# Altium project PPC_notebook_electrical_schematics_v0.7.PrjPcb (part 11 of 14)

## Sheet 27 Clock 2.SchDoc
size 420 x 297 mm
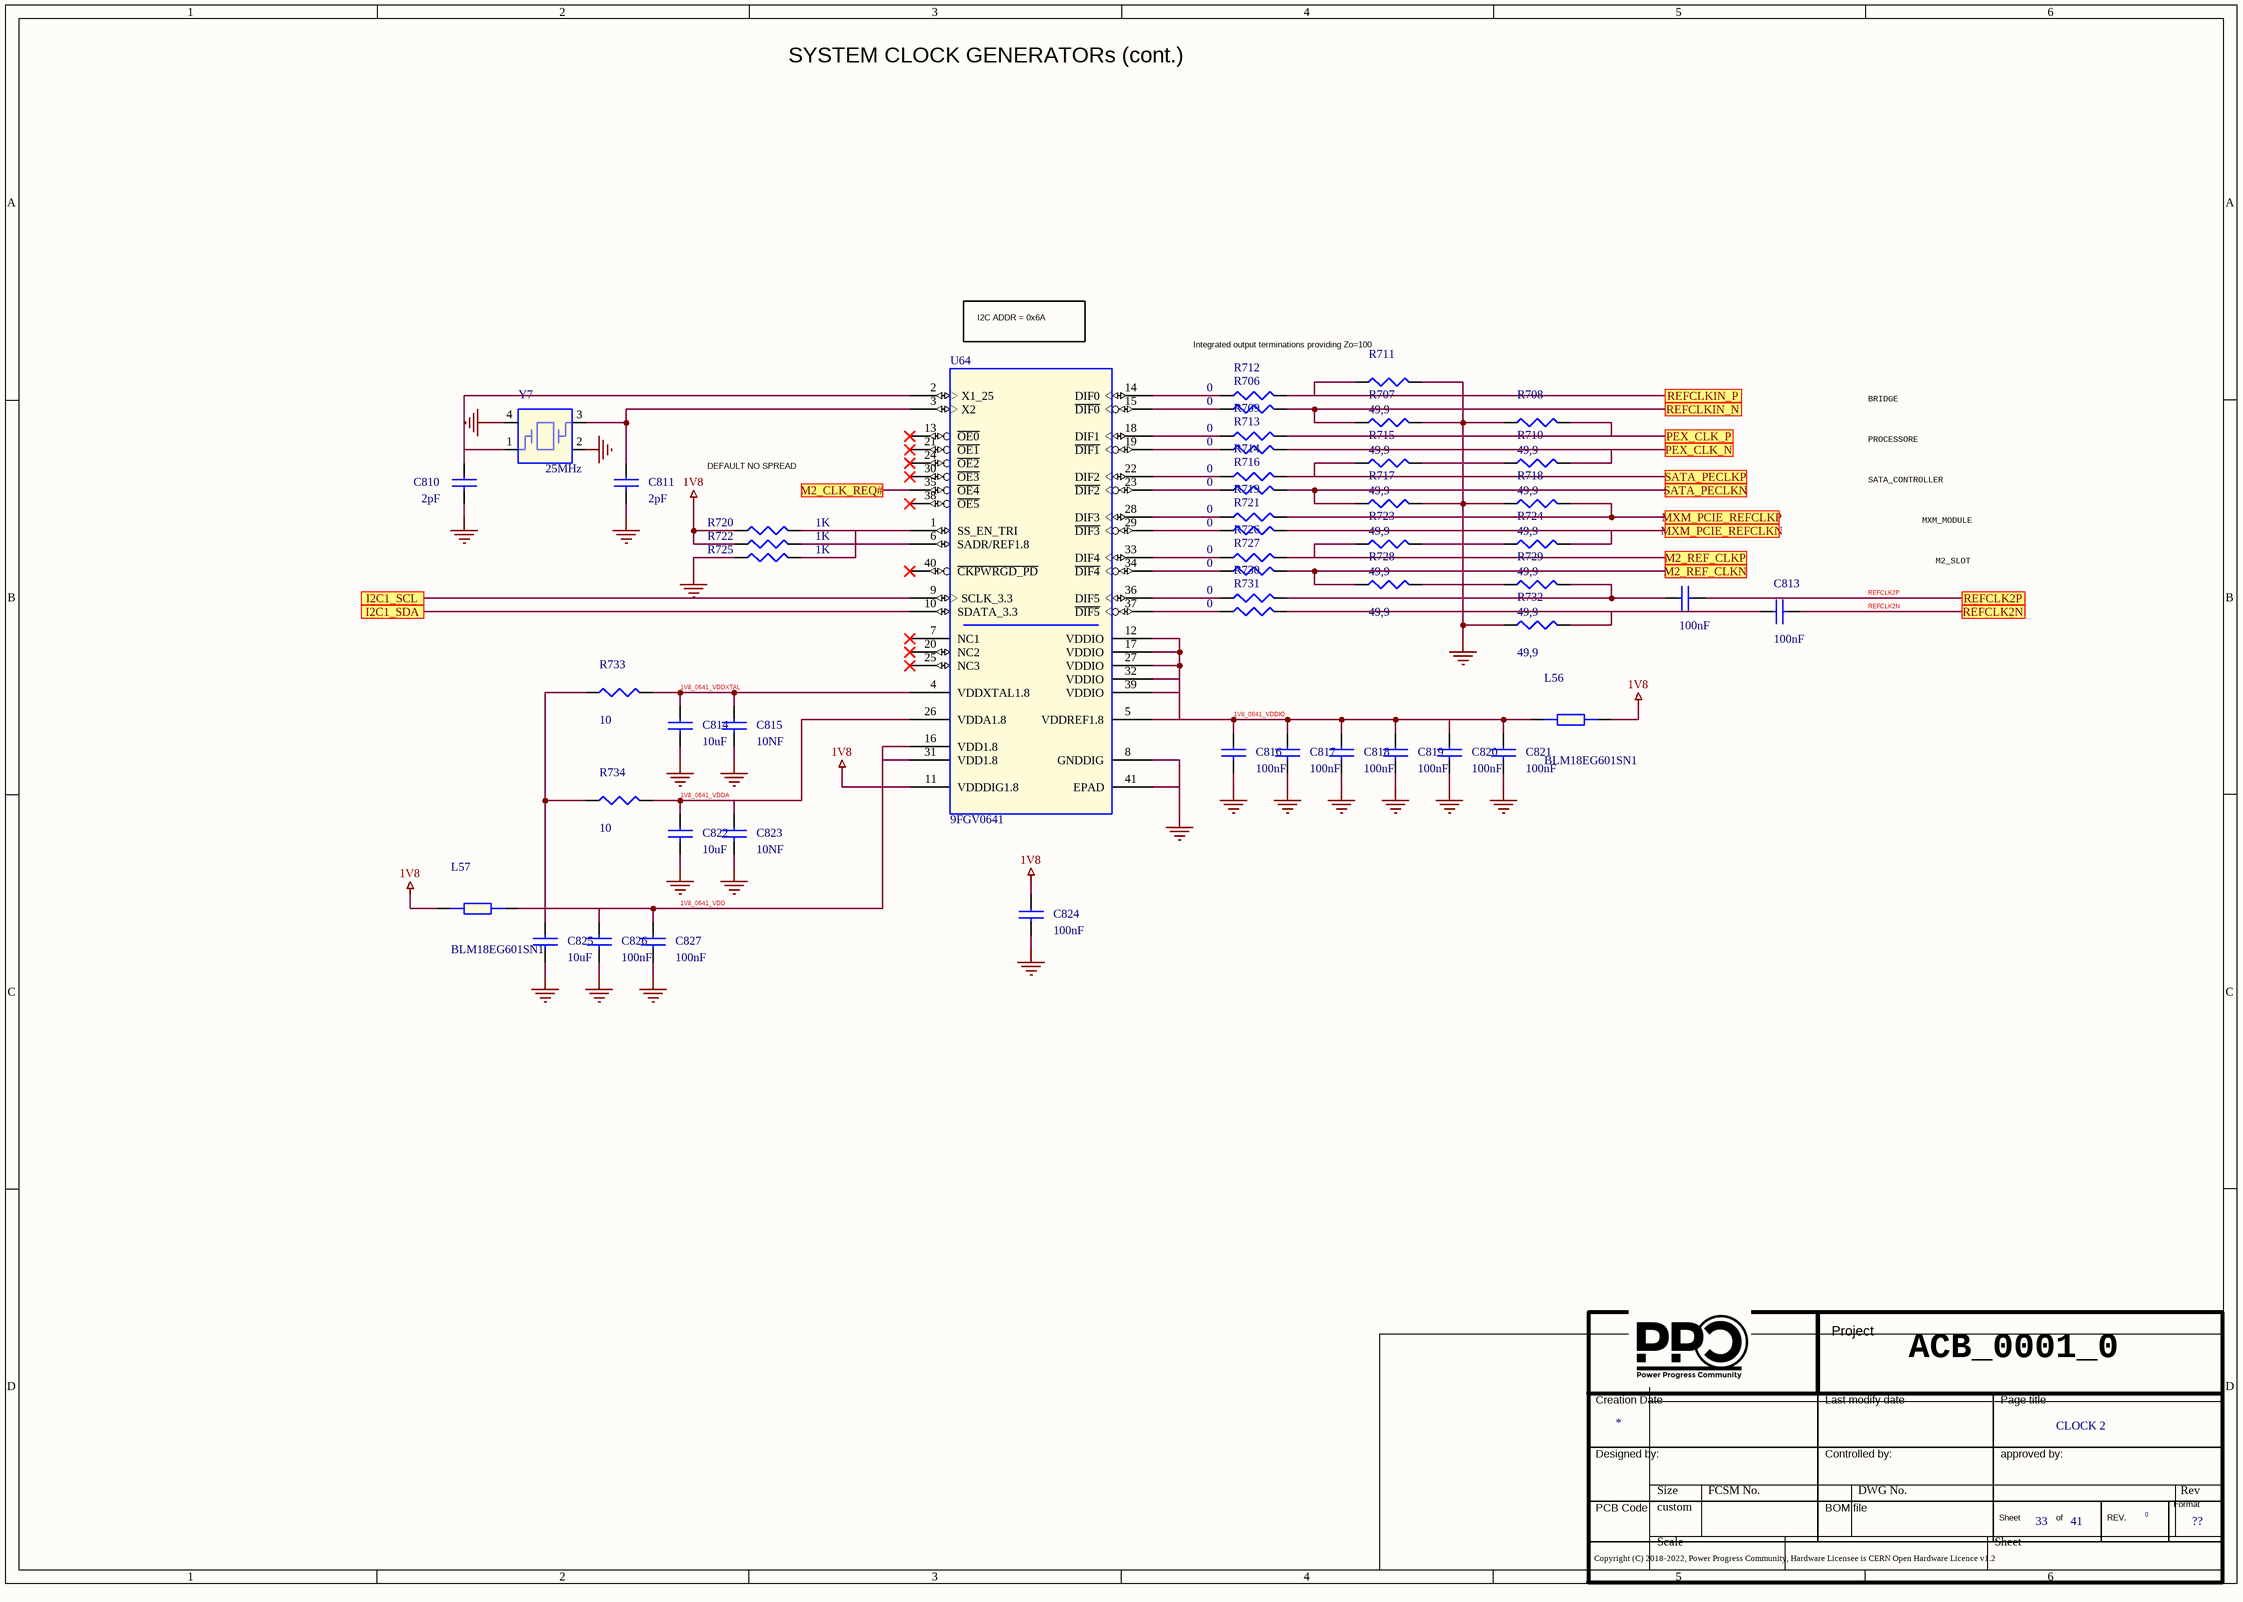
[diagram p59: 27 Clock 2.SchDoc]

### Parts
(Parts that share a designator on the sheet are numbered #1, #2 ... from top to bottom, then left to right.)
*#36  Doc: CLOCK 2  Page Count: 41  Page Number: 33  Page Size: ??  RevCode: 0  (hidden comment: Title_block_PPC)  (graphical)
C810  2pF  [SMD_0402]
C811  2pF  [SMD_0402]
C812  100nF  [SMD_0402]
C813  100nF  [SMD_0402]
C814  10uF  [SMD_0603]
C815  10NF  [SMD_0402]
C816  100nF  [SMD_0402]
C817  100nF  [SMD_0402]
C818  100nF  [SMD_0402]
C819  100nF  [SMD_0402]
C820  100nF  [SMD_0402]
C821  100nF  [SMD_0402]
C822  10uF  [SMD_0603]
C823  10NF  [SMD_0402]
C824  100nF  [SMD_0402]
C825  10uF  [SMD_0603]
C826  100nF  [SMD_0402]
C827  100nF  [SMD_0402]
L56  BLM18EG601SN1  [SMD_0603]
L57  BLM18EG601SN1  [SMD_0603]
R706  0  [SMD_0402]
R707  49,9  [SMD_0402]
R708  49,9  [SMD_0402]
R709  0  [SMD_0402]
R710  49,9  [SMD_0402]
R711  49,9  [SMD_0402]
R712  0  [SMD_0402]
R713  0  [SMD_0402]
R714  0  [SMD_0402]
R715  49,9  [SMD_0402]
R716  0  [SMD_0402]
R717  49,9  [SMD_0402]
R718  49,9  [SMD_0402]
R719  0  [SMD_0402]
R720  1K  [SMD_0402]
R721  0  [SMD_0402]
R722  1K  [SMD_0402]
R723  49,9  [SMD_0402]
R724  49,9  [SMD_0402]
R725  1K  [SMD_0402]
R726  0  [SMD_0402]
R727  0  [SMD_0402]
R728  49,9  [SMD_0402]
R729  49,9  [SMD_0402]
R730  0  [SMD_0402]
R731  0  [SMD_0402]
R732  49,9  [SMD_0402]
R733  10  [SMD_0402]
R734  10  [SMD_0402]
U64  9FGV0641  [qfn_p040_d040_b500_40_e380]
Y7  25MHz  [SMD_5.0x3.2]

### Ports
I2C1_SCL, I2C1_SDA, M2_CLK_REQ#, M2_REF_CLKN, M2_REF_CLKP, MXM_PCIE_REFCLKN, MXM_PCIE_REFCLKP, PEX_CLK_N, PEX_CLK_P, REFCLK2N, REFCLK2P, REFCLKIN_N, REFCLKIN_P, SATA_PECLKN, SATA_PECLKP

### Nets
1V8: C824.1 L56.2 L57.1 R720.1 R722.1 U64.11(VDDDIG1.8)
GND: C810.2 C811.2 C814.2 C815.2 C816.2 C817.2 C818.2 C819.2 C820.2 C821.2 C822.2 C823.2 C824.2 C825.2 C826.2 C827.2 R707.2 R708.1 R710.1 R711.2 R715.2 R717.2 R718.1 R723.2 R724.1 R725.1 R728.2 R729.1 R732.1 U64.8(GNDDIG) U64.41(EPAD) Y7.2 Y7.4
1V8_0641_VDD: C825.1 C826.1 C827.1 L57.2 R733.1 R734.1 U64.16(VDD1.8) U64.31(VDD1.8)
1V8_0641_VDDA: C822.1 C823.1 R734.2 U64.26(VDDA1.8)
1V8_0641_VDDIO: C816.1 C817.1 C818.1 C819.1 C820.1 C821.1 L56.1 U64.5(VDDREF1.8) U64.12(VDDIO) U64.17(VDDIO) U64.27(VDDIO) U64.32(VDDIO) U64.39(VDDIO)
1V8_0641_VDDXTAL: C814.1 C815.1 R733.2 U64.4(VDDXTAL1.8)
REFCLK2N: C813.2 ; port REFCLK2N
REFCLK2P: C812.2 ; port REFCLK2P
REFCLKIN_N: R706.2 R707.1 ; port REFCLKIN_N
REFCLKIN_P: R711.1 R712.2 ; port REFCLKIN_P
NetC113_1: R710.2 R713.2 ; port PEX_CLK_N
NetC114_1: R708.2 R709.2 ; port PEX_CLK_P
NetC810_1: C810.1 U64.2(X1_25) Y7.1
NetC811_1: C811.1 U64.3(X2) Y7.3
NetC812_1: C812.1 R729.2 R730.2
NetC813_1: C813.1 R731.2 R732.2
NetJ13_53: R727.2 R728.1 ; port M2_REF_CLKN
NetJ13_55: R723.1 R726.2 ; port M2_REF_CLKP
NetJ18_153: R721.2 R724.2 ; port MXM_PCIE_REFCLKN
NetJ18_155: R718.2 R719.2 ; port MXM_PCIE_REFCLKP
NetR108_1: U64.10(SDATA_3.3) ; port I2C1_SDA
NetR109_1: U64.9(SCLK_3.3) ; port I2C1_SCL
NetR420_2: R714.2 R715.1 ; port SATA_PECLKP
NetR421_2: R716.2 R717.1 ; port SATA_PECLKN
NetR435_1: U64.35(~{OE4}) ; port M2_CLK_REQ#
NetR706_1: R706.1 U64.15(~{DIF0})
NetR709_1: R709.1 U64.18(DIF1)
NetR712_1: R712.1 U64.14(DIF0)
NetR713_1: R713.1 U64.19(~{DIF1})
NetR714_1: R714.1 U64.22(DIF2)
NetR716_1: R716.1 U64.23(~{DIF2})
NetR719_1: R719.1 U64.28(DIF3)
NetR720_2: R720.2 R725.2 U64.1(SS_EN_TRI)
NetR721_1: R721.1 U64.29(~{DIF3})
NetR722_2: R722.2 U64.6(SADR/REF1.8)
NetR726_1: R726.1 U64.33(DIF4)
NetR727_1: R727.1 U64.34(~{DIF4})
NetR730_1: R730.1 U64.36(DIF5)
NetR731_1: R731.1 U64.37(~{DIF5})

Not connected (* = marked no-connect by the designer): U64 7(NC1)* 13(~{OE0})* 20(NC2)* 21(~{OE1})* 24(~{OE2})* 25(NC3)* 30(~{OE3})* 38(~{OE5})* 40(~{CKPWRGD_PD})*

### Notes on the sheet
- SYSTEM CLOCK GENERATORs (cont.)
- I2C ADDR = 0x6A
- Integrated output terminations providing Zo=100
- BRIDGE
- PROCESSORE
- DEFAULT NO SPREAD
- SATA_CONTROLLER
- MXM_MODULE
- M2_SLOT
- ACB_0001_0

### Library data of the parts
*#36 = Title_block_PPC: Title: T2080PCIe; Author: MICETEK; Page Create Date: March  8, 1995; Page Title: ?; Page Modify Date: *
C810 = CAP NP_Dup3: CAP CER 2PF 50V C0G/NPO 0402; Part Number: PASSIVE_1453; Manufacturer 1: YAGEO; Manufacturer Part Number 1: CC0402CRNPO9BN2R0D; RSM: RC0402; Part Type: Capacitors\Ceramic\SMD\0402; PCB Footprint: SMD_0402
C811 = CAP NP_Dup3: CAP CER 2PF 50V C0G/NPO 0402; Manufacturer Part Number 1: CC0402CRNPO9BN2R0D; Manufacturer 1: YAGEO; Part Number: PASSIVE_1453; RSM: RC0402; PCB Footprint: SMD_0402; Part Type: Capacitors\Ceramic\SMD\0402
C812 C813 = CAP NP_Dup3: as C755 on sheet 24 AUDIO CMEDIA; PCB Footprint: SMD_0402; Part Type: Capacitors\Ceramic\SMD\0402
C814 C822 C825 = CAP NP_Dup3: as C748 on sheet 24 AUDIO CMEDIA; PCB Footprint: SMD_0603; Part Type: Capacitors\Ceramic\SMD\0603
C815 C823 = CAP NP_Dup3: as C801 on sheet 26 Clock 1; Part Type: Capacitors\Ceramic\SMD\0402; PCB Footprint: SMD_0402
C816-C821 C824 C826 C827 = CAP NP_Dup3: as C765 on sheet 24 AUDIO CMEDIA; Part Type: Capacitors\Ceramic\SMD\0402; PCB Footprint: SMD_0402
L56 L57 = FERRITE_BEAD: as L44 on sheet 25 AUDIO_CONN; Part Type: Ferrite Beads\SMD\0603; PCB Footprint: SMD_0603
R706 R709 R712-R714 R716 R719 R721 R726 R727 R730 R731 = R_Dup6: as R612 on sheet 22 MXM_VIDEO_OUT; Part Type: Resistors\Fixed\SMD\0402\5%; Manufacturer Part Number 1: RESIS.CHIP 0R 5% 0402 SMD; PCB Footprint: SMD_0402
R707 R708 R710 R711 R715 R717 R718 R723 R724 R728 R729 R732 = R_Dup6: RESIS.CHIP 49,9R 1% 0402 SMD; Manufacturer Part Number 1: NCR04F49R9TRF; Manufacturer 1: NIC; Part Number: PASSIVE_738; RSM: RC0402; Part Type: Resistors\Fixed\SMD\0402\1%; PCB Footprint: SMD_0402
R720 R722 R725 = R_Dup6: as R671 on sheet 25 AUDIO_CONN; Part Type: Resistors\Fixed\SMD\0402\1%; Manufacturer Part Number 1: RESIS.CHIP 1K 1% 0402 SMD; PCB Footprint: SMD_0402
R733 R734 = R_Dup6: RESIS.CHIP 10R 5% 0402 SMD; Manufacturer 1: ROYAL OHM; Part Number: PASSIVE_811; RSM: RC0402; Manufacturer Part Number 1: RESIS.CHIP 10R 5% 0402 SMD; Part Type: Resistors\Fixed\SMD\0402\5%; PCB Footprint: SMD_0402
U64 = IDT9FGV0641: PCIe Gen1–4 clock generation for Riser Cards; Manufacturer 1: IDT; Part Number: LOGIC_359; MPN: 9FGV0641AKLF; RSM: QFN-40-5X5-P0_4-EP; PCB Footprint: 40-VFQFPN; Distributor 1: IDT; Manufacturer Part Number 1: 9FGV0641; Part Type: CLOCK\GENERATOR; TYPE: IC; Vendor: IDT
Y7 = CRYSTAL_4P: CRYSTAL 25.000 MHZ 20PF SMD; Manufacturer Part Number 1: ECS-250-20-30B-TR (ROHS COMPLIANT); Manufacturer 1: ECS; Part Number: MISC_166; RSM: XC-CSX2; PCB Footprint: SMD_5.0x3.2; Distributor 1: DIGIKEY (XC1124CT-ND); Part Type: Quartz

## Sheet 28 Core Pwr.SchDoc
size 420 x 297 mm
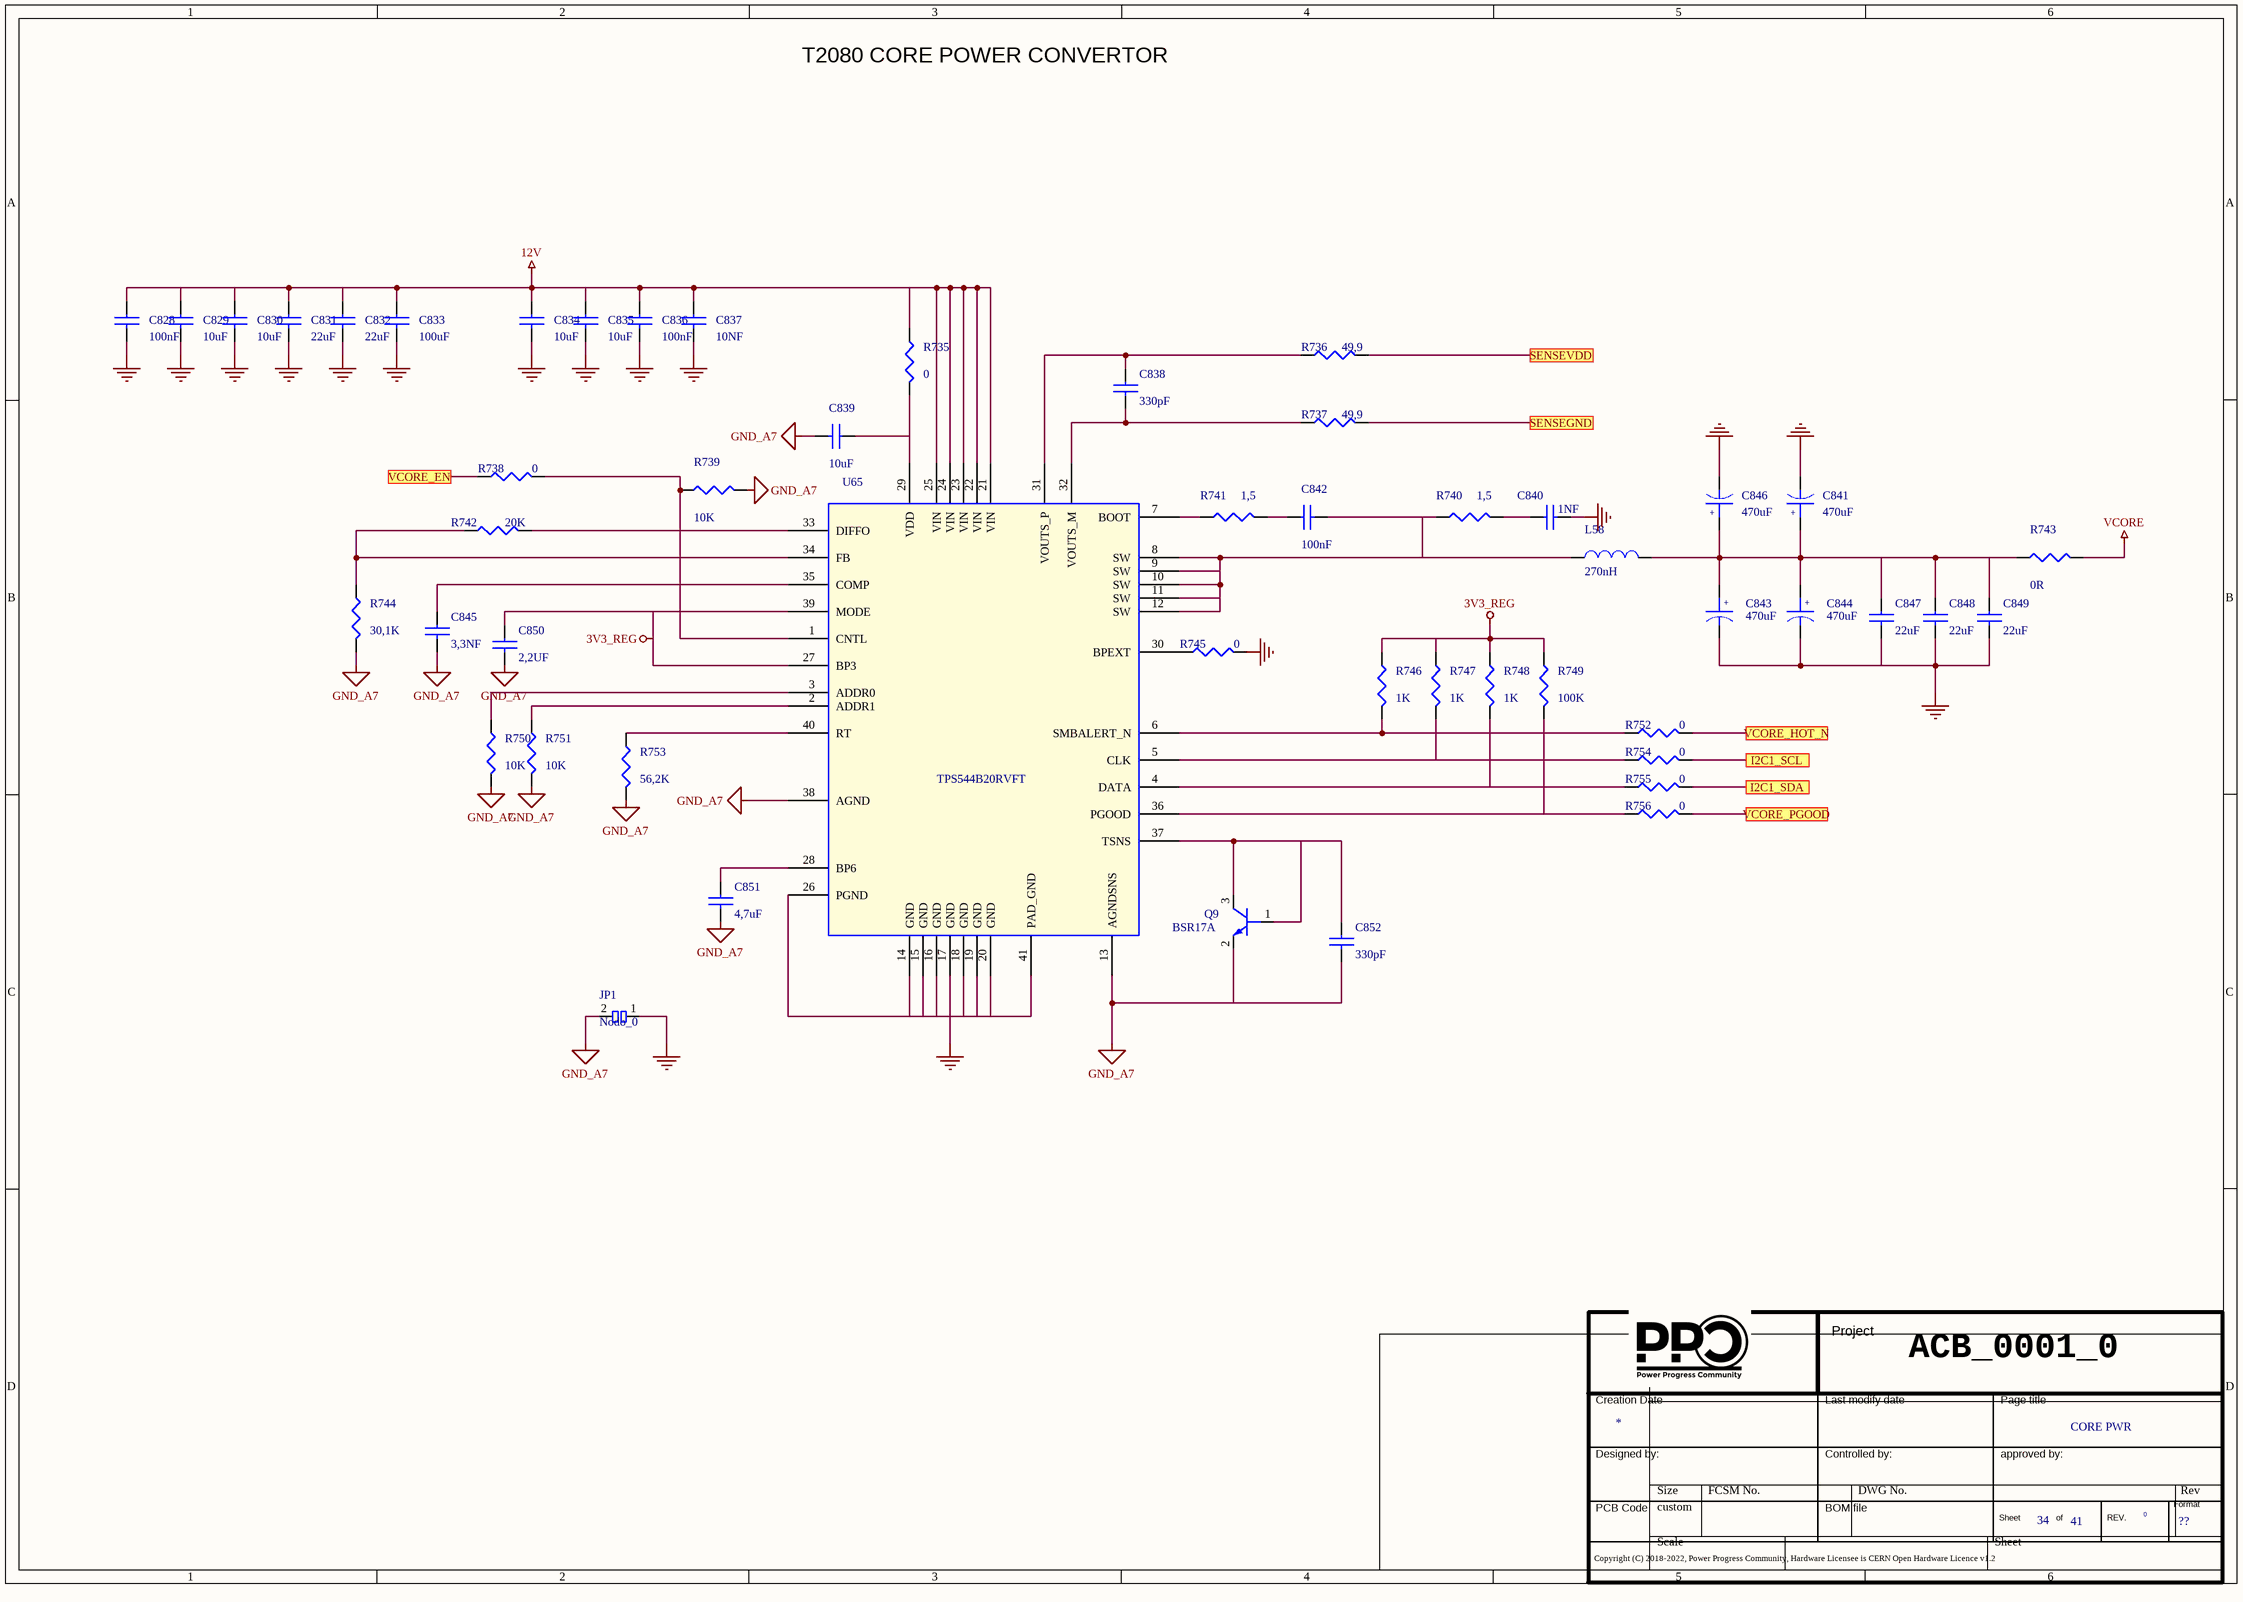
[diagram p60: 28 Core Pwr.SchDoc]

### Parts
(Parts that share a designator on the sheet are numbered #1, #2 ... from top to bottom, then left to right.)
*#37  Doc: CORE PWR  Page Count: 41  Page Number: 34  Page Size: ??  RevCode: 0  (hidden comment: Title_block_PPC)  (graphical)
C828  100nF  [SMD_0402]
C829  10uF  [SMD_0603]
C830  10uF  [SMD_0603]
C831  22uF  [SMD_0805]
C832  22uF  [SMD_0805]
C833  100uF  [SMD_1210]
C834  10uF  [SMD_0603]
C835  10uF  [SMD_0603]
C836  100nF  [SMD_0402]
C837  10NF  [SMD_0402]
C838  330pF  [SMD_0402]
C839  10uF  [SMD_0603]
C840  1NF  [SMD_0402]
C841  470uF  [SMD_CASE_GX]
C842  100nF  [SMD_0402]
C843  470uF  [SMD_CASE_GX]
C844  470uF  [SMD_CASE_GX]
C845  3,3NF  [SMD_0402]
C846  470uF  [SMD_CASE_GX]
C847  22uF  [SMD_1206]
C848  22uF  [SMD_1206]
C849  22uF  [SMD_1206]
C850  2,2UF  [SMD_0402]
C851  4,7uF  [SMD_0402]
C852  330pF  [SMD_0402]
JP1  Nodo_0
L58  270nH  [SMD_7_65X11mm]
Q9  BSR17A  [SOT_23]
R735  0  [SMD_1206]
R736  49,9  [SMD_0402]
R737  49,9  [SMD_0402]
R738  0  [SMD_0402]
R739  10K  [SMD_0402]
R740  1,5  [SMD_0402]
R741  1,5  [SMD_0402]
R742  20K  [SMD_0402]
R743  0R  [SMD_2010]
R744  30,1K  [SMD_0402]
R745  0  [SMD_0402]
R746  1K  [SMD_0402]
R747  1K  [SMD_0402]
R748  1K  [SMD_0402]
R749  100K  [SMD_0402]
R750  10K  [SMD_0402]
R751  10K  [SMD_0402]
R752  0  [SMD_0402]
R753  56,2K  [SMD_0402]
R754  0  [SMD_0402]
R755  0  [SMD_0402]
R756  0  [SMD_0402]
U65  TPS544B20RVFT  [LQFN40]

### Ports
I2C1_SCL, I2C1_SDA, SENSEGND, SENSEVDD, VCORE_EN, VCORE_HOT_N, VCORE_PGOOD

### Nets
3V3_REG: C850.1 R746.1 R747.1 R748.1 R749.1 U65.27(BP3) U65.39(MODE)
12V: C828.1 C829.1 C830.1 C831.1 C832.1 C833.1 C834.1 C835.1 C836.1 C837.1 R735.1 U65.21(VIN) U65.22(VIN) U65.23(VIN) U65.24(VIN) U65.25(VIN)
GND: C828.2 C829.2 C830.2 C831.2 C832.2 C833.2 C834.2 C835.2 C836.2 C837.2 C840.2 C841.2 C843.2 C844.2 C846.2 C847.2 C848.2 C849.2 JP1.1 R745.2 U65.14(GND) U65.15(GND) U65.16(GND) U65.17(GND) U65.18(GND) U65.19(GND) U65.20(GND) U65.26(PGND) U65.41(PAD_GND)
GND_A7: C839.2 C845.2 C850.2 C851.2 C852.2 JP1.2 Q9.2(E) R739.2 R744.2 R750.2 R751.2 R753.2 U65.13(AGNDSNS) U65.38(AGND)
VCORE: R743.2
NetC838_1: C838.1 R736.1 U65.31(VOUTS_P)
NetC838_2: C838.2 R737.1 U65.32(VOUTS_M)
NetC839_1: C839.1 R735.2 U65.29(VDD)
NetC840_1: C840.1 R740.2
NetC841_1: C841.1 C843.1 C844.1 C846.1 C847.1 C848.1 C849.1 L58.2 R743.1
NetC842_1: C842.1 R741.2
NetC842_2: C842.2 L58.1 R740.1 U65.8(SW) U65.9(SW) U65.10(SW) U65.11(SW) U65.12(SW)
NetC845_1: C845.1 U65.35(COMP)
NetC851_1: C851.1 U65.28(BP6)
NetC852_1: C852.1 Q9.1(B) Q9.3(C) U65.37(TSNS)
NetR108_1: R755.2 ; port I2C1_SDA
NetR109_1: R754.2 ; port I2C1_SCL
NetR292_2: R738.1 ; port VCORE_EN
NetR338_2: R756.2 ; port VCORE_PGOOD
NetR342_2: R752.2 ; port VCORE_HOT_N
NetR736_2: R736.2 ; port SENSEVDD
NetR737_2: R737.2 ; port SENSEGND
NetR738_2: R738.2 R739.1 U65.1(CNTL)
NetR741_1: R741.1 U65.7(BOOT)
NetR742_1: R742.1 R744.1 U65.34(FB)
NetR742_2: R742.2 U65.33(DIFFO)
NetR745_1: R745.1 U65.30(BPEXT)
NetR746_2: R746.2 R752.1 U65.6(SMBALERT_N)
NetR747_2: R747.2 R754.1 U65.5(CLK)
NetR748_2: R748.2 R755.1 U65.4(DATA)
NetR749_2: R749.2 R756.1 U65.36(PGOOD)
NetR750_1: R750.1 U65.3(ADDR0)
NetR751_1: R751.1 U65.2(ADDR1)
NetR753_1: R753.1 U65.40(RT)

### Notes on the sheet
- T2080 CORE POWER CONVERTOR
- ACB_0001_0
- (in symbol CAP POL) +

### Library data of the parts
*#37 = Title_block_PPC: Title: T2080PCIe; Author: MICETEK; Page Create Date: March  8, 1995; Page Title: ?; Page Modify Date: *
C828 C836 = CAP NP_Dup3: as C755 on sheet 24 AUDIO CMEDIA; PCB Footprint: SMD_0402; Part Type: Capacitors\Ceramic\SMD\0402
C829 C830 C834 C835 C839 = CAP NP_Dup3: as C782 on sheet 25 AUDIO_CONN; PCB Footprint: SMD_0603; Part Type: Capacitors\Ceramic\SMD\0603
C831 C832 = CAP NP_Dup3: 22UF 35V 20% 0805; Part Number: PASSIVE_224; Manufacturer 1: TDK; Manufacturer Part Number 1: C2012X5R1V226M125AC; RSM: RC0805; PCB Footprint: SMD_0805; Part Type: Capacitors\Ceramic\SMD\0805
C833 = CAP NP_Dup3: as C796 on sheet 25 AUDIO_CONN; PCB Footprint: SMD_1210; Part Type: Capacitors\Ceramic\SMD\1210
C837 = CAP NP_Dup3: COND.CER. 10NF 16V 0402 X7R SMD; Manufacturer Part Number 1: 0402YC103KAT2A; Manufacturer 1: AVX; Part Number: PASSIVE_28; RSM: RC0402; PCB Footprint: SMD_0402; Part Type: Capacitors\Ceramic\SMD\0402
C838 C852 = CAP NP_Dup3: CAP CER 330PF 50V 5% C0G 0402 HiRel; Manufacturer Part Number 1: CGJ2B2C0G1H331J050BA; Manufacturer 1: TDK; Part Number: PASSIVE_73; RSM: RC0402; PCB Footprint: SMD_0402; Part Type: Capacitors\Ceramic\SMD\0402
C840 = CAP NP_Dup3: COND.CER. 1NF 50V 0402 X7R SMD; Manufacturer Part Number 1: GRM15XR71H102KA86D; Manufacturer 1: Murata; Part Number: PASSIVE_47; RSM: RC0402; PCB Footprint: SMD_0402; Part Type: Capacitors\Ceramic\SMD\0402
C841 C846 = CAP POL: COND.TANT. 470uF 2v CASE-GX SMD; Part Number: PASSIVE_1473; Manufacturer 1: PANASONIC; Manufacturer Part Number 1: EEF-GX0D471R; RSM: TANT-D; PCB Footprint: SMD_CASE_GX; Part Type: Capacitors\Tantalum\SMD\CASE_GX
C842 = CAP NP_Dup3: as C765 on sheet 24 AUDIO CMEDIA; PCB Footprint: SMD_0402; Part Type: Capacitors\Ceramic\SMD\0402
C843 C844 = CAP POL: COND.TANT. 470uF 2v CASE-GX SMD; Manufacturer Part Number 1: EEF-GX0D471R; Manufacturer 1: PANASONIC; Part Number: PASSIVE_1473; RSM: TANT-D; PCB Footprint: SMD_CASE_GX; Part Type: Capacitors\Tantalum\SMD\CASE_GX
C845 = CAP NP_Dup3: COND.CER. 3,3NF 50V 0402 X7R SMD; Part Number: PASSIVE_69; RSM: RC0402; PCB Footprint: SMD_0402; Part Type: Capacitors\Ceramic\SMD\0402
C847-C849 = CAP NP_Dup3: CAP CER 22UF 16V 10% X5R 1206; Manufacturer Part Number 1: CL31A226KOHNNNE; Manufacturer 1: SAMSUNG; Part Number: PASSIVE_258; RSM: RC1206; PCB Footprint: SMD_1206; Part Type: Capacitors\Ceramic\SMD\1206
C850 = CAP NP_Dup3: CAP CER 2.2UF 25V X5R 0402; Manufacturer Part Number 1: GRM155R61E225ME15D; Manufacturer 1: Murata; Part Number: PASSIVE_1411; RSM: RC0402; PCB Footprint: SMD_0402; Part Type: Capacitors\Ceramic\SMD\0402
C851 = CAP NP_Dup3: CAP CER 4.7UF 10V 20% X5R 0402; Part Number: PASSIVE_80; Manufacturer 1: TDK; Manufacturer Part Number 1: C1005X5R1A475M050BC; RSM: RC0402; PCB Footprint: SMD_0402; Part Type: Capacitors\Ceramic\SMD\0402
JP1 = JUMPER_0: Serve solo al masterista per collegare i gnd; LNK_PART: SEZ0201_CHIUSO; Part Number: DA CODIFICARE; TECNO77: NODO; Part Type: NODO; RSM: NODO
L58 = INDUCTOR_Dup1: Induttori fissi 270nH Shld 20% 35.5A 228mOhms; Manufacturer Part Number 1: SLC1175-271MEB; Manufacturer 1: Coilcraft; Part Number: PASSIVE_1472; RSM: IND-BOURNS-SLC1175; PCB Footprint: SMD_7_65X11mm; Part Type: Inductors\SMD
Q9 = NPN BEC: TRANS NPN 40V 0.2A SOT-23; Manufacturer 1: ON Semi; Part Number: DISCRETE_327; PCB Footprint: SOT_23; Distributor 1: DIGIKEY ( / DIGIKEY(BSR17ATR-ND); Manufacturer Part Number 1: BSR17A; Part Type: Transistors\Bipolar\NPN; RSM: SOT-23
R735 = R_Dup6: RESIS. 0R 1/4W 1206 SMD E96; Manufacturer Part Number 1: RC1206JR-070RL; Manufacturer 1: YAGEO; Part Number: PASSIVE_1266; RSM: RC1206; PCB Footprint: SMD_1206; Part Type: Resistors\Fixed\SMD\1206\5%
R736 R737 = R_Dup6: RESIS.CHIP 49,9R 1% 0402 SMD; Part Number: PASSIVE_738; Manufacturer 1: NIC; Manufacturer Part Number 1: NCR04F49R9TRF; RSM: RC0402; PCB Footprint: SMD_0402; Part Type: Resistors\Fixed\SMD\0402\1%
R738 R745 R752 R754-R756 = R_Dup6: as R612 on sheet 22 MXM_VIDEO_OUT; PCB Footprint: SMD_0402; Part Type: Resistors\Fixed\SMD\0402\5%; Manufacturer Part Number 1: RESIS.CHIP 0R 5% 0402 SMD
R739 R750 R751 = R_Dup6: RESIS.CHIP 10K 5% 0402 SMD; Part Number: PASSIVE_814; Manufacturer 1: ROYAL OHM; RSM: RC0402; PCB Footprint: SMD_0402; Part Type: Resistors\Fixed\SMD\0402\5%; Manufacturer Part Number 1: RESIS.CHIP 10K 5% 0402 SMD
R740 = R_Dup6: RESIS.CHIP 1,5OHM 1% 0402 SMD; Part Number: PASSIVE_573; Manufacturer 1: WELWYN; Manufacturer Part Number 1: ASC0402-1R5FT10; RSM: RC0402; PCB Footprint: SMD_0402; Part Type: Resistors\Fixed\SMD\0402\1%
R741 = R_Dup6: RESIS.CHIP 1,5OHM 1% 0402 SMD; Manufacturer Part Number 1: ASC0402-1R5FT10; Manufacturer 1: WELWYN; Part Number: PASSIVE_573; RSM: RC0402; PCB Footprint: SMD_0402; Part Type: Resistors\Fixed\SMD\0402\1%
R742 = R_Dup6: as R646 on sheet 24 AUDIO CMEDIA; PCB Footprint: SMD_0402; Part Type: Resistors\Fixed\SMD\0402\1%
R743 = R_Dup6: RESIS. CHIP 0R 1/4W 1% 2010 SMD; Part Number: PASSIVE_1310; Manufacturer 1: Vishay; Manufacturer Part Number 1: CRCW20100000Z0EF; RSM: RC2010; PCB Footprint: SMD_2010; Part Type: Resistors\Fixed\SMD\2010\1%
R744 = R_Dup6: RESIS.CHIP 30K1 1% 0402 SMD; Manufacturer 1: ROYAL OHM; Part Number: PASSIVE_683; RSM: RC0402; PCB Footprint: SMD_0402; Manufacturer Part Number 1: RESIS.CHIP 30K1 1% 0402 SMD; Part Type: Resistors\Fixed\SMD\0402\1%
R746 = R_Dup6: RESIS.CHIP 1K 5% 0402 SMD; Manufacturer 1: ROYAL OHM; Part Number: PASSIVE_832; RSM: RC0402; PCB Footprint: SMD_0402; Manufacturer Part Number 1: RESIS.CHIP 1K 5% 0402 SMD; Part Type: Resistors\Fixed\SMD\0402\5%
R747 R748 = R_Dup6: RESIS.CHIP 1K 5% 0402 SMD; Part Number: PASSIVE_832; Manufacturer 1: ROYAL OHM; RSM: RC0402; PCB Footprint: SMD_0402; Part Type: Resistors\Fixed\SMD\0402\5%; Manufacturer Part Number 1: RESIS.CHIP 1K 5% 0402 SMD
R749 = R_Dup6: RESIS.CHIP 100K 5% 0402 SMD; Part Number: PASSIVE_813; Manufacturer 1: ROYAL OHM; RSM: RC0402; PCB Footprint: SMD_0402; Part Type: Resistors\Fixed\SMD\0402\5%; Manufacturer Part Number 1: RESIS.CHIP 100K 5% 0402 SMD
R753 = R_Dup6: RESIS.CHIP 56,2K 1% 0402 SMD; Manufacturer 1: ROYAL OHM; Part Number: PASSIVE_755; RSM: RC0402; PCB Footprint: SMD_0402; Manufacturer Part Number 1: RESIS.CHIP 56,2K 1% 0402 SMD; Part Type: Resistors\Fixed\SMD\0402\1%
U65 = TPS544X20: IC REG BUCK ADJ 20A 40LQFN; Part Number: LINEAR_334; Manufacturer 1: TEXAS; RSM: LQFN-40-EP-7_1X5_1; PCB Footprint: LQFN40; Part Type: Regulators\Switching; Manufacturer Part Number 1: TPS544B20RVFT; Distributor 1: DIGIKEY(296-37876-1-ND)